# EAGLE design XenoGC (EAGLE 6.5.0)
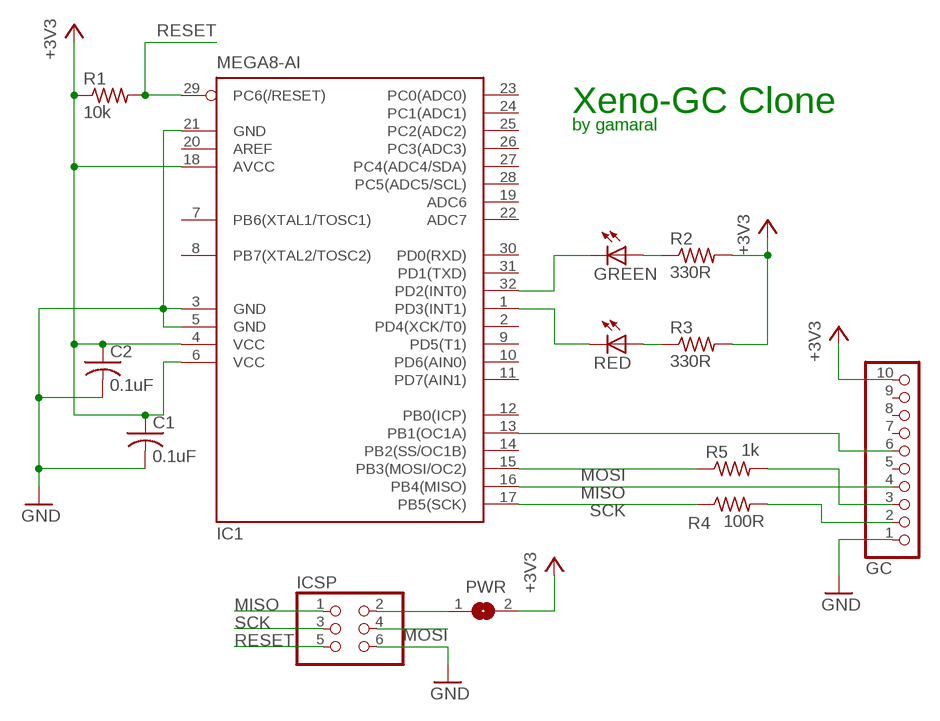
[diagram p0: schematic, sheet 1]

## Parts
C1  0.1uF  C-USC0805K  [C0805K]
C2  0.1uF  C-USC0805K  [C0805K]
GC  PINHD-1X10  [1X10]
GREEN  LEDSML1206  [SML1206]
IC1  MEGA8-AI  [TQFP32-08]
ICSP  PINHD-2X3  [2X03]
PWR  SJ  [SJ]
R1  10k  R-US_R0805W  [R0805W]
R2  330R  R-US_R0805W  [R0805W]
R3  330R  R-US_R0805W  [R0805W]
R4  100R  R-US_R0805W  [R0805W]
R5  1k  R-US_R0805W  [R0805W]
RED  LEDSML1206  [SML1206]

## Nets
+3V3: C1.1 C2.1 GC.10 IC1.4(VCC) IC1.6(VCC) IC1.18(AVCC) PWR.2 R1.1 R2.2 R3.2
GC2: GC.2 R4.2
GC3: GC.3 R5.2
GND: C1.2 C2.2 GC.1 IC1.3(GND) IC1.5(GND) IC1.21(GND) ICSP.6
ICSP-VCC: ICSP.2 PWR.1
LED1: GREEN.C IC1.32(PD2(INT0))
LED2: IC1.1(PD3(INT1)) RED.C
MISO: GC.4 IC1.16(PB4(MISO)) ICSP.1
MOSI: IC1.15(PB3(MOSI/OC2)) ICSP.4 R5.1
N$3: GREEN.A R2.1
N$4: R3.1 RED.A
PB1: GC.6 IC1.13(PB1(OC1A))
RESET: IC1.29(PC6(/RESET)) ICSP.5 R1.2
SCK: IC1.17(PB5(SCK)) ICSP.3 R4.1
Unconnected: GC.5 GC.7 GC.8 GC.9 IC1.2(PD4(XCK/T0)) IC1.7(PB6(XTAL1/TOSC1)) IC1.8(PB7(XTAL2/TOSC2)) IC1.9(PD5(T1)) IC1.10(PD6(AIN0)) IC1.11(PD7(AIN1)) IC1.12(PB0(ICP)) IC1.14(PB2(SS/OC1B)) IC1.19(ADC6) IC1.20(AREF) IC1.22(ADC7) IC1.23(PC0(ADC0)) IC1.24(PC1(ADC1)) IC1.25(PC2(ADC2)) IC1.26(PC3(ADC3)) IC1.27(PC4(ADC4/SDA)) IC1.28(PC5(ADC5/SCL)) IC1.30(PD0(RXD)) IC1.31(PD1(TXD))

## Notes on the sheet
- Xeno-GC Clone
- by gamaral

## Library data of the parts
C1 C2 = resistor:C-US: CAPACITOR, American symbol
GC = pinhead:PINHD-1X10: PIN HEADER
GREEN RED = led:LED: LED OSRAM: - CHIPLED LG R971, LG N971, LY N971, LG Q971, LY Q971, LO R971, LY R971 LH N974, LH R974 LS Q976, LO Q976, LY Q976 LO Q996 - Hyper CHIPLED LW Q18S LB Q993, LB Q99A, LB R99A - SideLED LS A670, LO A670, LY A670, LG A670, LP A670 LB A673, LV A673, LT A673, LW A673 LH A674 LY A675 LS A676, LA A676, LO A676, LY A676, LW A676 LS A679, LY A679, LG A679 - Hyper Micro SIDELED® LS Y876, LA Y876, LO Y876, LY Y876 LT Y87S - SmartLED LW L88C, LW L88S LB L89C, LB L89S, LG L890 LS L89K, LO L89K, LY L89K LS L896, LA L896, LO L896, LY L896 - TOPLED LS T670, LO T670, LY T670, LG T670, LP T670 LSG T670, LSP T670, LSY T670, LOP T670, LYG T670 LG T671, LOG T671, LSG T671 LB T673, LV T673, LT T673, LW T673 LH T674 LS T676, LA T676, LO T676, LY T676, LB T676, LH T676, LSB T676, LW T676 LB T67C, LV T67C, LT T67C, LS T67K, LO T67K, LY T67K, LW E67C LS E67B, LA E67B, LO E67B, LY E67B, LB E67C, LV E67C, LT E67C LW T67C LS T679, LY T679, LG T679 LS T770, LO T770, LY T770, LG T770, LP T770 LB T773, LV T773, LT T773, LW T773 LH T774 LS E675, LA E675, LY E675, LS T675 LS T776, LA T776, LO T776, LY T776, LB T776 LHGB T686 LT T68C, LB T68C - Hyper Mini TOPLED® LB M676 - Mini TOPLED Santana® LG M470 LS M47K, LO M47K, LY M47K Source: http://www.osram.convergy.de LUXEON: - LUMILED® LXK2-PW12-R00, LXK2-PW12-S00, LXK2-PW14-U00, LXK2-PW14-V00 LXK2-PM12-R00, LXK2-PM12-S00, LXK2-PM14-U00 LXK2-PE12-Q00, LXK2-PE12-R00, LXK2-PE12-S00, LXK2-PE14-T00, LXK2-PE14-U00 LXK2-PB12-K00, LXK2-PB12-L00, LXK2-PB12-M00, LXK2-PB14-N00, LXK2-PB14-P00, LXK2-PB14-Q00 LXK2-PR12-L00, LXK2-PR12-M00, LXK2-PR14-Q00, LXK2-PR14-R00 LXK2-PD12-Q00, LXK2-PD12-R00, LXK2-PD12-S00 LXK2-PH12-R00, LXK2-PH12-S00 LXK2-PL12-P00, LXK2-PL12-Q00, LXK2-PL12-R00 Source: www.luxeon.com KINGBRIGHT: KA-3528ASYC Source: www.kingbright.com
IC1 = atmel:MEGA8: MICROCONTROLLER 8 Kbytes FLASH, 1 kbytes SRAM, 512 bytes EEPROM, USART, 6-channel 10 bit ADC, 2-channel 8 bit ADC Pin compatible with Atmega48, ATMega88, ATMega168 Source: avr.lbr; MPN: ATMEGA8-16AU; OC_FARNELL: 9171371; OC_NEWARK: 73M8863
ICSP = pinhead:PINHD-2X3: PIN HEADER
PWR = jumper:SJ: SMD solder JUMPER
R1-R5 = resistor:R-US_: RESISTOR, American symbol

## Board
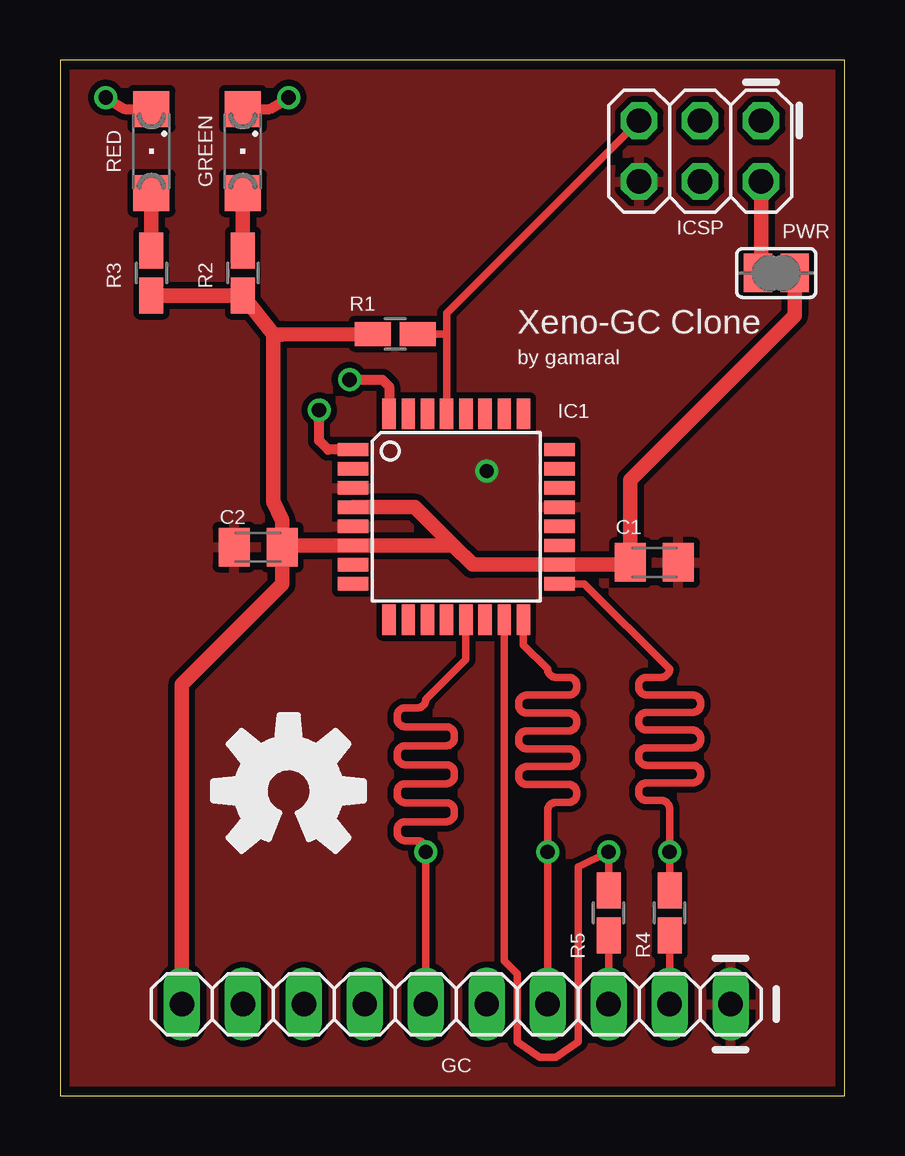
[diagram p1: board, top side]
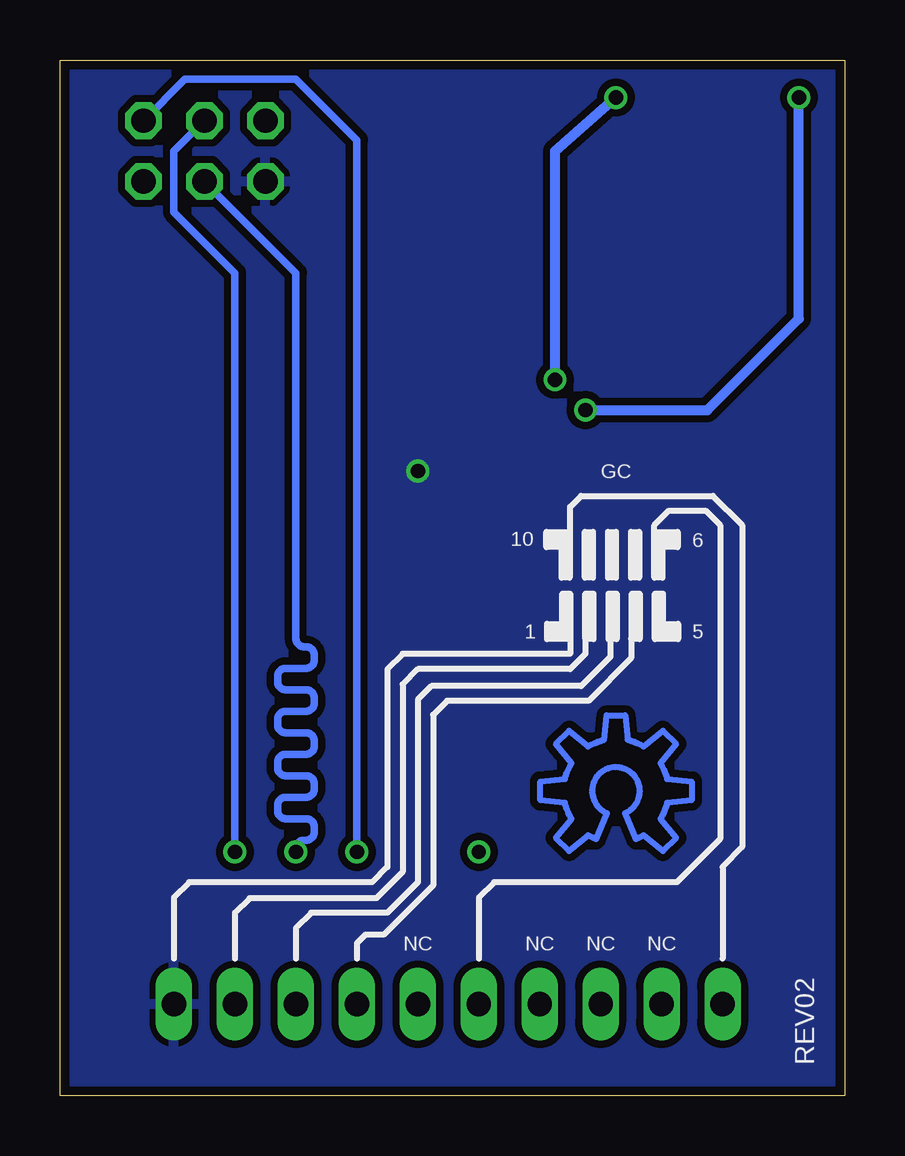
[diagram p2: board, bottom side, seen from below]

Size 32.69 x 43.17 mm. Coordinates in mm from the lower left corner, seen from the top.
Outline: 0,0 32.69,0 32.69,43.17 0,43.17 0,0
Copper layers (1*16): Top 0.0356mm / dielectric 1.5011mm / Bottom 0.0356mm
Design rules "LaenPCBOrder": minimum track width 6mil, minimum drill 13mil, track to track 6mil, track to pad 6mil, pad to pad 6mil, via to via 6mil, smd to smd 6mil, copper to edge 15mil, drill to drill 6mil, minimum pad ring 7mil, minimum via ring 7mil, stop-mask expansion 4mil, vias tented up to drill 0mil, thermal gap 10mil

### Footprints (pad centres in the part's own frame; a part is rotated, then mirrored left to right if it is on the bottom)
C0805K = smd 1.3 x 1.6: 1 -1,0; 2 1,0
1X10 = drill 1.016 long: 1 -11.43,0; 2 -8.89,0; 3 -6.35,0; 4 -3.81,0; 5 -1.27,0; 6 1.27,0; 7 3.81,0; 8 6.35,0; 9 8.89,0; 10 11.43,0
SML1206 = smd 1.5 x 1.5: A 1.75,0; C -1.75,0
TQFP32-08 = smd 1.27 x 0.559: 1 -4.293,2.8; 2 -4.293,2; 3 -4.293,1.2; 4 -4.293,0.4; 5 -4.293,-0.4; 6 -4.293,-1.2; 7 -4.293,-2; 8 -4.293,-2.8; 17 4.293,-2.8; 18 4.293,-2; 19 4.293,-1.2; 20 4.293,-0.4; 21 4.293,0.4; 22 4.293,1.2; 23 4.293,2; 24 4.293,2.8 | smd 0.559 x 1.27: 9 -2.8,-4.293; 10 -2,-4.293; 11 -1.2,-4.293; 12 -0.4,-4.293; 13 0.4,-4.293; 14 1.2,-4.293; 15 2,-4.293; 16 2.8,-4.293; 25 2.8,4.293; 26 2,4.293; 27 1.2,4.293; 28 0.4,4.293; 29 -0.4,4.293; 30 -1.2,4.293; 31 -2,4.293; 32 -2.8,4.293
2X03 = drill 1.016 octagon: 1 -2.54,-1.27; 2 -2.54,1.27; 3 0,-1.27; 4 0,1.27; 5 2.54,-1.27; 6 2.54,1.27
SJ = smd 1.168 x 1.6: 1 -0.762,0; 2 0.762,0
R0805W = smd 1.5 x 1: 1 -0.94,0; 2 0.94,0

### Placement (x,y rotation side)
C1  24.77,22.23 0 top
C2  8.26,22.86 180 top
GC  16.51,3.81 180 top
GREEN  7.62,39.37 270 top
IC1  16.51,24.13 0 top
ICSP  26.67,39.37 180 top
PWR  29.84,34.29 0 top
R1  13.97,31.75 0 top
R2  7.62,34.29 270 top
R3  3.81,34.29 270 top
R4  25.4,7.62 270 top
R5  22.86,7.62 270 top
RED  3.81,39.37 270 top

### Tracks (layer width: path | path; a pad name or v marks a point on that pad's centre or on a via)
+3V3
  Top 0.61: C2.1 9.32,22.93 IC1.6 16.39,22.93 | GC.10 5.08,17.14 9.26,21.32 C2.1 | R3.2 R2.2 8.89,31.75 | 8.89,31.75 8.89,24.77 9.26,23.97 C2.1 | 8.89,31.75 9.24,31.73 R1.1 | 16.39,22.93 17.19,22.13 IC1.18 23.77,22.13 C1.1 23.77,25.67 30.61,32.51 PWR.2 | 16.39,22.93 14.79,24.53 IC1.4
GC2
  Top 0.305: R4.2 GC.2
GC3
  Top 0.305: R5.2 GC.3
GND  (via drill 0.6)
  other vias: 17.78,26.04
  pour Top (isolate 0.254): 0,43.18 0,0 33.02,0 33.02,43.18
  pour Bottom (isolate 0.305): 0,43.18 33.02,43.18 33.02,0 0,0
ICSP-VCC
  Top 0.61: ICSP.2 29.21,34.42 PWR.1
LED1  (via drill 0.6)
  Top 0.406: GREEN.C 8.73,41.12 v9.53,41.6 | v12.06,29.84 13.44,29.84 13.72,29.57 IC1.32
  Bottom 0.406: v12.06,29.84 12.06,39.37 v9.53,41.6
LED2  (via drill 0.6)
  Top 0.406: v1.91,41.6 2.69,41.12 RED.C | IC1.1 11.17,26.93 10.79,27.3 v10.79,28.57
  Bottom 0.406: v10.79,28.57 5.71,28.57 1.91,32.38 v1.91,41.6
MISO  (via drill 0.6)
  Top 0.305: GC.4 v20.32,10.16 20.32,11.88 arc-90 20.66,12.22 21.19,12.22 arc90 21.53,12.57 21.53,12.63 arc90 21.19,12.97 19.45,12.97 arc-90 19.11,13.31 19.11,13.37 arc-90 19.45,13.71 21.19,13.71 arc90 21.53,14.06 21.53,14.12 arc90 21.19,14.46 19.45,14.46 arc-90 19.11,14.8 19.11,14.86 arc-90 19.45,15.2 21.19,15.2 arc90 21.53,15.55 21.53,15.61 arc90 21.19,15.95 19.45,15.95 arc-90 19.11,16.29 19.11,16.35 arc-90 19.45,16.69 21.19,16.69 arc90 21.53,17.04 21.53,17.09 arc90 21.19,17.44 20.66,17.44 arc-90 20.32,17.78 19.31,18.79 IC1.16
  Bottom 0.305: ICSP.1 27.48,42.37 22.86,42.37 20.32,39.83 v20.32,10.16
MOSI  (via drill 0.6)
  Top 0.305: IC1.15 18.51,5.62 19.05,5.08 19.05,2.23 19.99,1.6 20.65,1.6 21.59,2.23 21.59,9.53 v22.86,10.16 22.86,8.89 22.53,8.89 R5.1
  Bottom 0.305: ICSP.4 22.86,34.29 22.86,19.05 arc-90 22.52,18.71 22.44,18.71 arc90 22.1,18.36 22.1,18.15 arc90 22.44,17.81 23.28,17.81 arc-90 23.62,17.47 23.62,17.26 arc-90 23.28,16.92 22.44,16.92 arc90 22.1,16.57 22.1,16.36 arc90 22.44,16.02 23.28,16.02 arc-90 23.62,15.68 23.62,15.47 arc-90 23.28,15.12 22.44,15.12 arc90 22.1,14.78 22.1,14.57 arc90 22.44,14.23 23.28,14.23 arc-90 23.62,13.88 23.62,13.68 arc-90 23.28,13.33 22.44,13.33 arc90 22.1,12.99 22.1,12.78 arc90 22.44,12.44 23.28,12.44 arc-90 23.62,12.09 23.62,11.88 arc-90 23.28,11.54 22.44,11.54 arc90 22.1,11.2 22.1,10.99 arc90 22.44,10.64 22.52,10.64 arc-90 22.86,10.3 v22.86,10.16
N$1
  Bottom 0.254: 10.36,10.68 arc10 10.68,10.85 11.48,10.2 12.03,10.74 11.38,11.54 arc19 11.65,12.21 12.68,12.31 12.68,13.09 11.65,13.19 arc19 11.38,13.86 12.03,14.65 11.48,15.2 10.68,14.55 arc19 10.02,14.83 9.91,15.85 9.14,15.85 9.03,14.83 arc19 8.37,14.55 7.57,15.2 7.02,14.65 7.67,13.86 arc19 7.4,13.19 6.37,13.09 6.37,12.31 7.4,12.21 arc19 7.67,11.54 7.02,10.74 7.57,10.2 8.37,10.85 arc10 8.69,10.68 9.14,11.78 arc-68 8.53,12.7 arc-248 9.9,11.78 10.36,10.68
N$3
  Top 0.61: GREEN.A R2.1
N$4
  Top 0.61: RED.A R3.1
PB1  (via drill 0.6)
  Top 0.305: GC.6 v15.24,10.16 15.24,10.28 arc90 14.9,10.63 14.39,10.63 arc-90 14.05,10.97 14.05,11.07 arc-90 14.39,11.42 16.09,11.42 arc90 16.43,11.76 16.43,11.87 arc90 16.09,12.21 14.39,12.21 arc-90 14.05,12.55 14.05,12.66 arc-90 14.39,13 16.09,13 arc90 16.43,13.34 16.43,13.45 arc90 16.09,13.79 14.39,13.79 arc-90 14.05,14.14 14.05,14.24 arc-90 14.39,14.58 16.09,14.58 arc90 16.43,14.93 16.43,15.03 arc90 16.09,15.38 14.39,15.38 arc-90 14.05,15.72 14.05,15.82 arc-90 14.39,16.17 14.9,16.17 arc90 15.24,16.51 16.91,18.18 IC1.13
RESET
  Top 0.305: IC1.29 16.11,31.75 | 16.11,31.75 16.11,32.62 ICSP.5 | R1.2 16.11,31.75
SCK  (via drill 0.6)
  Top 0.305: IC1.17 21.85,21.33 25.4,17.78 arc-90 25.06,17.44 24.45,17.44 arc90 24.11,17.09 24.11,17.05 arc90 24.45,16.7 26.35,16.7 arc-90 26.7,16.36 26.7,16.31 arc-90 26.35,15.97 24.45,15.97 arc90 24.11,15.63 24.11,15.58 arc90 24.45,15.24 26.35,15.24 arc-90 26.7,14.89 26.7,14.85 arc-90 26.35,14.5 24.45,14.5 arc90 24.11,14.16 24.11,14.11 arc90 24.45,13.77 26.35,13.77 arc-90 26.7,13.43 26.7,13.38 arc-90 26.35,13.04 24.45,13.04 arc90 24.11,12.69 24.11,12.64 arc90 24.45,12.3 25.06,12.3 arc-90 25.4,11.96 v25.4,10.16 R4.1
  Bottom 0.305: ICSP.3 27.94,39.37 27.94,36.83 25.4,34.29 v25.4,10.16

### Text on the board
bPlace: GC | 6 | 10 | 5 | 1 | NC | NC | NC | NC
tNames: Xeno-GC Clone | by gamaral
bNames: REV02